# Altium project fpga-proj.PrjPcb
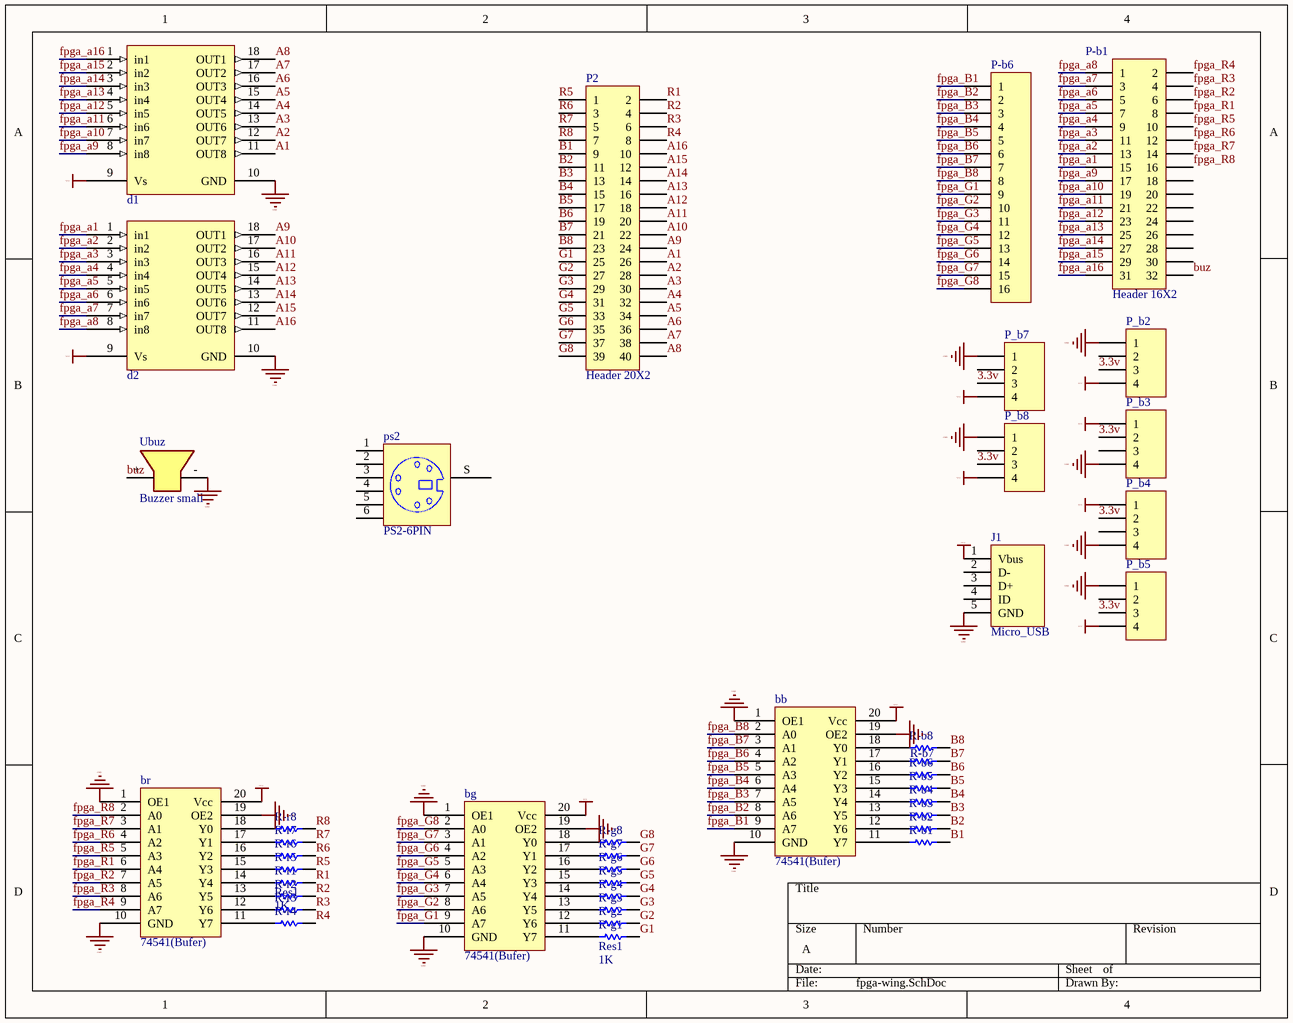
[diagram p0: fpga-wing.SchDoc]
2 sheets, 44 parts. Net scope: global (net labels, ports and power ports of the same name join across sheets).
Board files: fpga-wing.PcbDoc, Vertical.PcbDoc
Sheets:
  fpga-wing.SchDoc
  Vertical.SchDoc

## Sheet fpga-wing.SchDoc
size A

### Parts
(Parts that share a designator on the sheet are numbered #1, #2 ... from top to bottom, then left to right.)
bb  74541(Bufer)  [SO20_M]
bg  74541(Bufer)  [SO20_M]
br  74541(Bufer)  [SO20_M]
d1#1  udn2981  [DIP18]  (value not drawn)
d2#1  udn2981  [DIP18]  (value not drawn)
J1  Micro_USB  [microUSB]
P2  Header 20X2  [HDR2X20]
P-b1  Header 16X2  [HDR2X16]
P-b6  Header 16  [My_1X16]  (value not drawn)
P_b2  Header 4  [My_1X04]  (value not drawn)
P_b3  Header 4  [My_1X04]  (value not drawn)
P_b4  Header 4  [My_1X04]  (value not drawn)
P_b5  Header 4  [My_1X04]  (value not drawn)
P_b7  Header 4  [My_1X04]  (value not drawn)
P_b8  Header 4  [My_1X04]  (value not drawn)
ps2  PS2-6PIN  [My_PS2-6PIN]
R-b1  Res1  [SMD_RES_1206]  (value not drawn)
R-b2  Res1  [SMD_RES_1206]  (value not drawn)
R-b3  Res1  [SMD_RES_1206]  (value not drawn)
R-b4  Res1  [SMD_RES_1206]  (value not drawn)
R-b5  Res1  [SMD_RES_1206]  (value not drawn)
R-b6  Res1  [SMD_RES_1206]  (value not drawn)
R-b7  Res1  [SMD_RES_1206]  (value not drawn)
R-b8  Res1  [SMD_RES_1206]  (value not drawn)
R-g1  Res1  value 1K  [SMD_RES_1206]
R-g2  Res1  [SMD_RES_1206]  (value not drawn)
R-g3  Res1  [SMD_RES_1206]  (value not drawn)
R-g4  Res1  [SMD_RES_1206]  (value not drawn)
R-g5  Res1  [SMD_RES_1206]  (value not drawn)
R-g6  Res1  [SMD_RES_1206]  (value not drawn)
R-g7  Res1  [SMD_RES_1206]  (value not drawn)
R-g8  Res1  [SMD_RES_1206]  (value not drawn)
R-r1  Res1  value 1K  [SMD_RES_1206]
R-r2  Res1  [SMD_RES_1206]  (value not drawn)
R-r3  Res1  [SMD_RES_1206]  (value not drawn)
R-r4  Res1  [SMD_RES_1206]  (value not drawn)
R-r5  Res1  [SMD_RES_1206]  (value not drawn)
R-r6  Res1  [SMD_RES_1206]  (value not drawn)
R-r7  Res1  [SMD_RES_1206]  (value not drawn)
R-r8  Res1  [SMD_RES_1206]  (value not drawn)
Ubuz  Buzzer small  [My_Buzzer]

### Nets
GND: bb.1(OE1) bb.10(GND) bb.19(OE2) bg.1(OE1) bg.10(GND) bg.19(OE2) br.1(OE1) br.10(GND) br.19(OE2) d1#1.10(GND) d2#1.10(GND) J1.5(GND) P_b2.1 P_b3.4 P_b4.4 P_b5.1 P_b7.1 P_b8.1 Ubuz.-
VCC: bb.20(Vcc) bg.20(Vcc) br.20(Vcc) d1#1.9(Vs) d2#1.9(Vs) J1.1(Vbus) P_b2.4 P_b3.1 P_b4.1 P_b5.4 P_b7.4 P_b8.4
3.3v: P_b2.3 P_b3.2 P_b4.2 P_b5.3 P_b7.3 P_b8.3
A1: d1#1.11(OUT8) P2.26
A2: d1#1.12(OUT7) P2.28
A3: d1#1.13(OUT6) P2.30
A4: d1#1.14(OUT5) P2.32
A5: d1#1.15(OUT4) P2.34
A6: d1#1.16(OUT3) P2.36
A7: d1#1.17(OUT2) P2.38
A8: d1#1.18(OUT1) P2.40
A9: d2#1.18(OUT1) P2.24
A10: d2#1.17(OUT2) P2.22
A11: d2#1.16(OUT3) P2.20
A12: d2#1.15(OUT4) P2.18
A13: d2#1.14(OUT5) P2.16
A14: d2#1.13(OUT6) P2.14
A15: d2#1.12(OUT7) P2.12
A16: d2#1.11(OUT8) P2.10
B1: P2.9 R-b1.2
B2: P2.11 R-b2.2
B3: P2.13 R-b3.2
B4: P2.15 R-b4.2
B5: P2.17 R-b5.2
B6: P2.19 R-b6.2
B7: P2.21 R-b7.2
B8: P2.23 R-b8.2
buz: P-b1.32 Ubuz.+
fpga_a1: d2#1.1(in1) P-b1.15
fpga_a2: d2#1.2(in2) P-b1.13
fpga_a3: d2#1.3(in3) P-b1.11
fpga_a4: d2#1.4(in4) P-b1.9
fpga_a5: d2#1.5(in5) P-b1.7
fpga_a6: d2#1.6(in6) P-b1.5
fpga_a7: d2#1.7(in7) P-b1.3
fpga_a8: d2#1.8(in8) P-b1.1
fpga_a9: d1#1.8(in8) P-b1.17
fpga_a10: d1#1.7(in7) P-b1.19
fpga_a11: d1#1.6(in6) P-b1.21
fpga_a12: d1#1.5(in5) P-b1.23
fpga_a13: d1#1.4(in4) P-b1.25
fpga_a14: d1#1.3(in3) P-b1.27
fpga_a15: d1#1.2(in2) P-b1.29
fpga_a16: d1#1.1(in1) P-b1.31
fpga_B1: bb.9(A7) P-b6.1
fpga_B2: bb.8(A6) P-b6.2
fpga_B3: bb.7(A5) P-b6.3
fpga_B4: bb.6(A4) P-b6.4
fpga_B5: bb.5(A3) P-b6.5
fpga_B6: bb.4(A2) P-b6.6
fpga_B7: bb.3(A1) P-b6.7
fpga_B8: bb.2(A0) P-b6.8
fpga_G1: bg.9(A7) P-b6.9
fpga_G2: bg.8(A6) P-b6.10
fpga_G3: bg.7(A5) P-b6.11
fpga_G4: bg.6(A4) P-b6.12
fpga_G5: bg.5(A3) P-b6.13
fpga_G6: bg.4(A2) P-b6.14
fpga_G7: bg.3(A1) P-b6.15
fpga_G8: bg.2(A0) P-b6.16
fpga_R1: br.6(A4) P-b1.8
fpga_R2: br.7(A5) P-b1.6
fpga_R3: br.8(A6) P-b1.4
fpga_R4: br.9(A7) P-b1.2
fpga_R5: br.5(A3) P-b1.10
fpga_R6: br.4(A2) P-b1.12
fpga_R7: br.3(A1) P-b1.14
fpga_R8: br.2(A0) P-b1.16
G1: P2.25 R-g1.2
G2: P2.27 R-g2.2
G3: P2.29 R-g3.2
G4: P2.31 R-g4.2
G5: P2.33 R-g5.2
G6: P2.35 R-g6.2
G7: P2.37 R-g7.2
G8: P2.39 R-g8.2
R1: P2.2 R-r1.2
R2: P2.4 R-r2.2
R3: P2.6 R-r3.2
R4: P2.8 R-r4.2
R5: P2.1 R-r5.2
R6: P2.3 R-r6.2
R7: P2.5 R-r7.2
R8: P2.7 R-r8.2
Netbb_11: bb.11(Y7) R-b1.1
Netbb_12: bb.12(Y6) R-b2.1
Netbb_13: bb.13(Y5) R-b3.1
Netbb_14: bb.14(Y4) R-b4.1
Netbb_15: bb.15(Y3) R-b5.1
Netbb_16: bb.16(Y2) R-b6.1
Netbb_17: bb.17(Y1) R-b7.1
Netbb_18: bb.18(Y0) R-b8.1
Netbg_11: bg.11(Y7) R-g1.1
Netbg_12: bg.12(Y6) R-g2.1
Netbg_13: bg.13(Y5) R-g3.1
Netbg_14: bg.14(Y4) R-g4.1
Netbg_15: bg.15(Y3) R-g5.1
Netbg_16: bg.16(Y2) R-g6.1
Netbg_17: bg.17(Y1) R-g7.1
Netbg_18: bg.18(Y0) R-g8.1
Netbr_11: br.11(Y7) R-r4.1
Netbr_12: br.12(Y6) R-r3.1
Netbr_13: br.13(Y5) R-r2.1
Netbr_14: br.14(Y4) R-r1.1
Netbr_15: br.15(Y3) R-r5.1
Netbr_16: br.16(Y2) R-r6.1
Netbr_17: br.17(Y1) R-r7.1
Netbr_18: br.18(Y0) R-r8.1

Not connected (* = marked no-connect by the designer): J1 2(D-) 3(D+) 4(ID); P-b1 18 20 22 24 26 28 30; P_b2 2; P_b3 3; P_b4 3; P_b5 2; P_b7 2; P_b8 2; ps2 1 2 3 4 5 6 S

### Library data of the parts
P2 = Header 20X2: Header, 20-Pin, Dual row; LatestRevisionDate: 17-Jul-2002; LatestRevisionNote: Re-released for DXP Platform.; Publisher: Altium Limited
P-b1 = Header 16X2: Header, 16-Pin, Dual row; LatestRevisionDate: 17-Jul-2002; LatestRevisionNote: Re-released for DXP Platform.; Publisher: Altium Limited
P-b6 = Header 16: Header, 16-Pin; LatestRevisionDate: 17-Jul-2002; LatestRevisionNote: Re-released for DXP Platform.; Publisher: Altium Limited
P_b2-P_b5 P_b7 P_b8 = Header 4: Header, 4-Pin; LatestRevisionDate: 17-Jul-2002; LatestRevisionNote: Re-released for DXP Platform.; Publisher: Altium Limited
ps2 = PS2-6PIN: 6 Pin Through Hole PS2 Socket (Kycon P/N); Published: 17-Dec-2003; Publisher: Altium Limited; ComponentLink1Description: Manufacturer Link; ComponentLink1URL: http://www.oupiin.com/prodindx.html#Headers
R-b1-R-b8 R-g2-R-g8 R-r2-R-r8 = Res1: Resistor; Value: 1K; Published: 8-Jun-2000; LatestRevisionDate: 17-Jul-2002; LatestRevisionNote: Re-released for DXP Platform.; PackageReference: AXIAL-0.3; Publisher: Altium Limited; PackageDescription: Axial Device, Thru-Hole; 2 Leads; 0.3 in Pin Spacing
R-g1 R-r1 = Res1: Resistor; Published: 8-Jun-2000; LatestRevisionDate: 17-Jul-2002; LatestRevisionNote: Re-released for DXP Platform.; PackageReference: AXIAL-0.3; Publisher: Altium Limited; PackageDescription: Axial Device, Thru-Hole; 2 Leads; 0.3 in Pin Spacing
Ubuz = Buzzer: 5-12v small buzzer (12mm)

## Sheet Vertical.SchDoc
size A
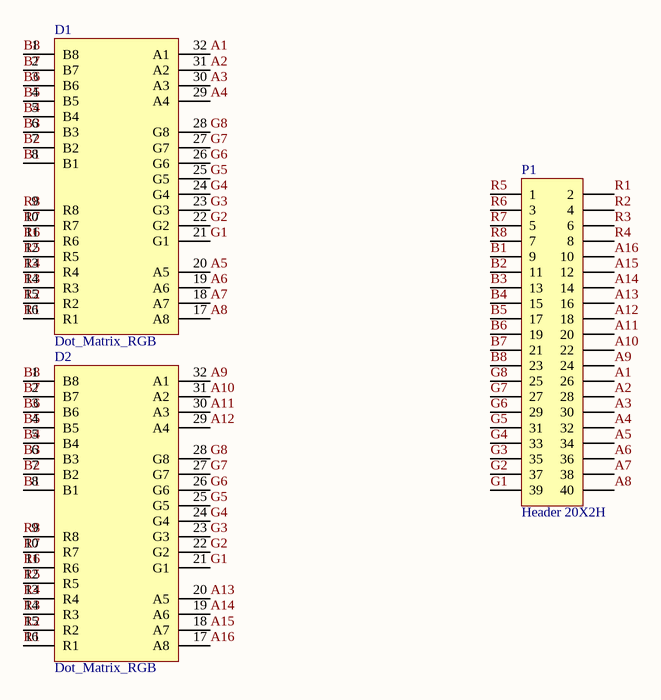
[diagram p1: Vertical.SchDoc]

### Parts
(Parts that share a designator on the sheet are numbered #1, #2 ... from top to bottom, then left to right.)
D1#2  Dot_Matrix_RGB  [Dot_Matrix_RGB]
D2#2  Dot_Matrix_RGB  [Dot_Matrix_RGB]
P1  Header 20X2H  [HDR2X20H]

### Nets
A1: D1#2.32(A1) P1.26
A2: D1#2.31(A2) P1.28
A3: D1#2.30(A3) P1.30
A4: D1#2.29(A4) P1.32
A5: D1#2.20(A5) P1.34
A6: D1#2.19(A6) P1.36
A7: D1#2.18(A7) P1.38
A8: D1#2.17(A8) P1.40
A9: D2#2.32(A1) P1.24
A10: D2#2.31(A2) P1.22
A11: D2#2.30(A3) P1.20
A12: D2#2.29(A4) P1.18
A13: D2#2.20(A5) P1.16
A14: D2#2.19(A6) P1.14
A15: D2#2.18(A7) P1.12
A16: D2#2.17(A8) P1.10
B1: D1#2.8(B1) D2#2.8(B1) P1.9
B2: D1#2.7(B2) D2#2.7(B2) P1.11
B3: D1#2.6(B3) D2#2.6(B3) P1.13
B4: D1#2.5(B4) D2#2.5(B4) P1.15
B5: D1#2.4(B5) D2#2.4(B5) P1.17
B6: D1#2.3(B6) D2#2.3(B6) P1.19
B7: D1#2.2(B7) D2#2.2(B7) P1.21
B8: D1#2.1(B8) D2#2.1(B8) P1.23
G1: D1#2.21(G1) D2#2.21(G1) P1.39
G2: D1#2.22(G2) D2#2.22(G2) P1.37
G3: D1#2.23(G3) D2#2.23(G3) P1.35
G4: D1#2.24(G4) D2#2.24(G4) P1.33
G5: D1#2.25(G5) D2#2.25(G5) P1.31
G6: D1#2.26(G6) D2#2.26(G6) P1.29
G7: D1#2.27(G7) D2#2.27(G7) P1.27
G8: D1#2.28(G8) D2#2.28(G8) P1.25
R1: D1#2.16(R1) D2#2.16(R1) P1.2
R2: D1#2.15(R2) D2#2.15(R2) P1.4
R3: D1#2.14(R3) D2#2.14(R3) P1.6
R4: D1#2.13(R4) D2#2.13(R4) P1.8
R5: D1#2.12(R5) D2#2.12(R5) P1.1
R6: D1#2.11(R6) D2#2.11(R6) P1.3
R7: D1#2.10(R7) D2#2.10(R7) P1.5
R8: D1#2.9(R8) D2#2.9(R8) P1.7

### Library data of the parts
P1 = Header 20X2H: Header, 20-Pin, Dual row, Right Angle; LatestRevisionDate: 17-Jul-2002; LatestRevisionNote: Re-released for DXP Platform.; Publisher: Altium Limited

## Nets that join several sheets
A1: fpga-wing (d1#1.11 P2.26), Vertical (D1#2.32 P1.26)
A2: fpga-wing (d1#1.12 P2.28), Vertical (D1#2.31 P1.28)
A3: fpga-wing (d1#1.13 P2.30), Vertical (D1#2.30 P1.30)
A4: fpga-wing (d1#1.14 P2.32), Vertical (D1#2.29 P1.32)
A5: fpga-wing (d1#1.15 P2.34), Vertical (D1#2.20 P1.34)
A6: fpga-wing (d1#1.16 P2.36), Vertical (D1#2.19 P1.36)
A7: fpga-wing (d1#1.17 P2.38), Vertical (D1#2.18 P1.38)
A8: fpga-wing (d1#1.18 P2.40), Vertical (D1#2.17 P1.40)
A9: fpga-wing (d2#1.18 P2.24), Vertical (D2#2.32 P1.24)
A10: fpga-wing (d2#1.17 P2.22), Vertical (D2#2.31 P1.22)
A11: fpga-wing (d2#1.16 P2.20), Vertical (D2#2.30 P1.20)
A12: fpga-wing (d2#1.15 P2.18), Vertical (D2#2.29 P1.18)
A13: fpga-wing (d2#1.14 P2.16), Vertical (D2#2.20 P1.16)
A14: fpga-wing (d2#1.13 P2.14), Vertical (D2#2.19 P1.14)
A15: fpga-wing (d2#1.12 P2.12), Vertical (D2#2.18 P1.12)
A16: fpga-wing (d2#1.11 P2.10), Vertical (D2#2.17 P1.10)
B1: fpga-wing (P2.9 R-b1.2), Vertical (D1#2.8 D2#2.8 P1.9)
B2: fpga-wing (P2.11 R-b2.2), Vertical (D1#2.7 D2#2.7 P1.11)
B3: fpga-wing (P2.13 R-b3.2), Vertical (D1#2.6 D2#2.6 P1.13)
B4: fpga-wing (P2.15 R-b4.2), Vertical (D1#2.5 D2#2.5 P1.15)
B5: fpga-wing (P2.17 R-b5.2), Vertical (D1#2.4 D2#2.4 P1.17)
B6: fpga-wing (P2.19 R-b6.2), Vertical (D1#2.3 D2#2.3 P1.19)
B7: fpga-wing (P2.21 R-b7.2), Vertical (D1#2.2 D2#2.2 P1.21)
B8: fpga-wing (P2.23 R-b8.2), Vertical (D1#2.1 D2#2.1 P1.23)
G1: fpga-wing (P2.25 R-g1.2), Vertical (D1#2.21 D2#2.21 P1.39)
G2: fpga-wing (P2.27 R-g2.2), Vertical (D1#2.22 D2#2.22 P1.37)
G3: fpga-wing (P2.29 R-g3.2), Vertical (D1#2.23 D2#2.23 P1.35)
G4: fpga-wing (P2.31 R-g4.2), Vertical (D1#2.24 D2#2.24 P1.33)
G5: fpga-wing (P2.33 R-g5.2), Vertical (D1#2.25 D2#2.25 P1.31)
G6: fpga-wing (P2.35 R-g6.2), Vertical (D1#2.26 D2#2.26 P1.29)
G7: fpga-wing (P2.37 R-g7.2), Vertical (D1#2.27 D2#2.27 P1.27)
G8: fpga-wing (P2.39 R-g8.2), Vertical (D1#2.28 D2#2.28 P1.25)
R1: fpga-wing (P2.2 R-r1.2), Vertical (D1#2.16 D2#2.16 P1.2)
R2: fpga-wing (P2.4 R-r2.2), Vertical (D1#2.15 D2#2.15 P1.4)
R3: fpga-wing (P2.6 R-r3.2), Vertical (D1#2.14 D2#2.14 P1.6)
R4: fpga-wing (P2.8 R-r4.2), Vertical (D1#2.13 D2#2.13 P1.8)
R5: fpga-wing (P2.1 R-r5.2), Vertical (D1#2.12 D2#2.12 P1.1)
R6: fpga-wing (P2.3 R-r6.2), Vertical (D1#2.11 D2#2.11 P1.3)
R7: fpga-wing (P2.5 R-r7.2), Vertical (D1#2.10 D2#2.10 P1.5)
R8: fpga-wing (P2.7 R-r8.2), Vertical (D1#2.9 D2#2.9 P1.7)